# EAGLE design PWM (EAGLE 6.6.0)
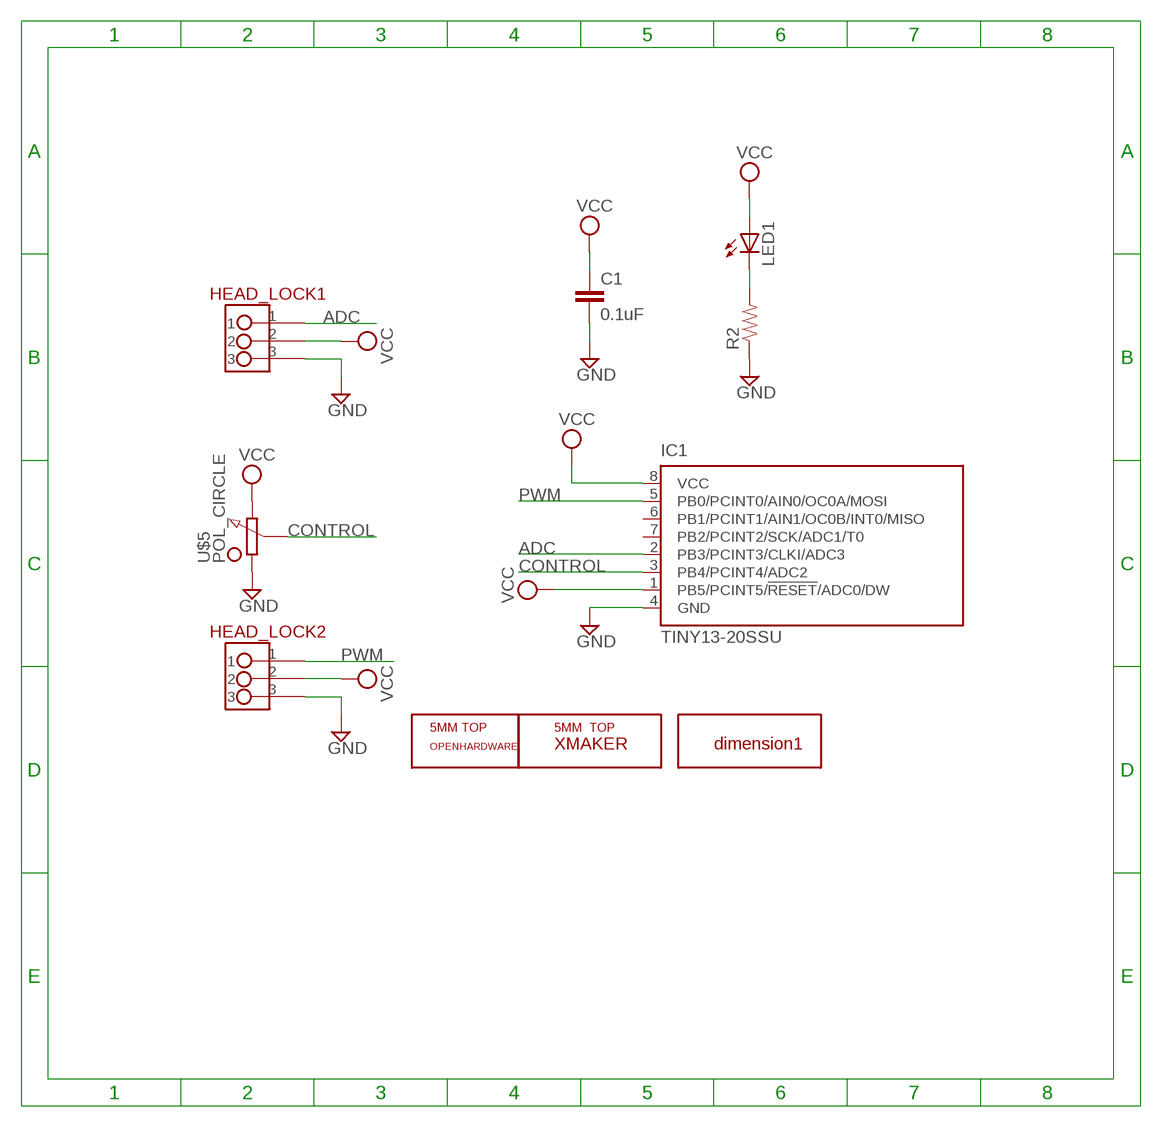
[diagram p0: schematic, sheet 1]

## Parts
C1  0.1uF  CAP0603-CAP  [0603-CAP]
HEAD_LOCK1  HEAD_LOCK  [HEAD_LOCK]
HEAD_LOCK2  HEAD_LOCK  [HEAD_LOCK]
IC1  TINY13-20SSU  [8S1]
LED1  LED_ESML0603  [LED_SML0603]
R2  0.27OHM-1/10W-1%(0603)  [0603-RES]
U$2  XMAKERLOGO_5MM_TOP  [XMAKERLOGO_5MM_TOP]
U$3  DIMENSION1  [DIMENSION1]
U$4  OPENHARDWARE_5MM_TOP  [OPENSOURCE_5MM_TOP]
U$5  POL_CIRCLE  [POT_CIRCLE]

## Nets
ADC: HEAD_LOCK1.1 IC1.2(PB3/PCINT3/CLKI/ADC3)
CONTROL: IC1.3(PB4/PCINT4/ADC2) U$5.P$2
GND: C1.2 HEAD_LOCK1.3 HEAD_LOCK2.3 IC1.4(GND) R2.1 U$5.P$3
N$1: LED1.C R2.2
PWM: HEAD_LOCK2.1 IC1.5(PB0/PCINT0/AIN0/OC0A/MOSI)
VCC: C1.1 HEAD_LOCK1.2 HEAD_LOCK2.2 IC1.1(PB5/PCINT5/!RESET!/ADC0/DW) IC1.8(VCC) LED1.A U$5.P$1
Unconnected: IC1.6(PB1/PCINT1/AIN1/OC0B/INT0/MISO) IC1.7(PB2/PCINT2/SCK/ADC1/T0)

## Library data of the parts
C1 = SparkFun-Passives:CAP: Capacitor Standard 0603 ceramic capacitor, and 0.1" leaded capacitor.
HEAD_LOCK1 HEAD_LOCK2 = Xmaker:HEAD_LOCK
IC1 = atmel:TINY13: 8-bit AVR Microcontroller with 1K Bytes In-System Programmable Flash Source: http://www.atmel.com/dyn/resources/prod_documents/2535S.pdf; MPN: ATTINY13-20SSU; OC_FARNELL: 1455133; OC_NEWARK: 58M3771
LED1 = eagle-ltspice:LED_E: LED Source: http://www.osram.convergy.de Source: www.luxeon.com Source: www.kingbright.com; SPICEMODEL: NONE; SPICEPREFIX: D; SPICETYPE: diode
R2 = SparkFun-Resistors:0.27OHM-1/10W-1%(0603): RES-08787; PROD_ID: RES-08787
U$2 = Xmaker_yuhui:XMAKERLOGO_5MM_TOP
U$3 = Xmaker_yuhui:DIMENSION1
U$4 = Xmaker_yuhui:OPENHARDWARE_5MM_TOP
U$5 = Xmaker:POL_CIRCLE

## Board
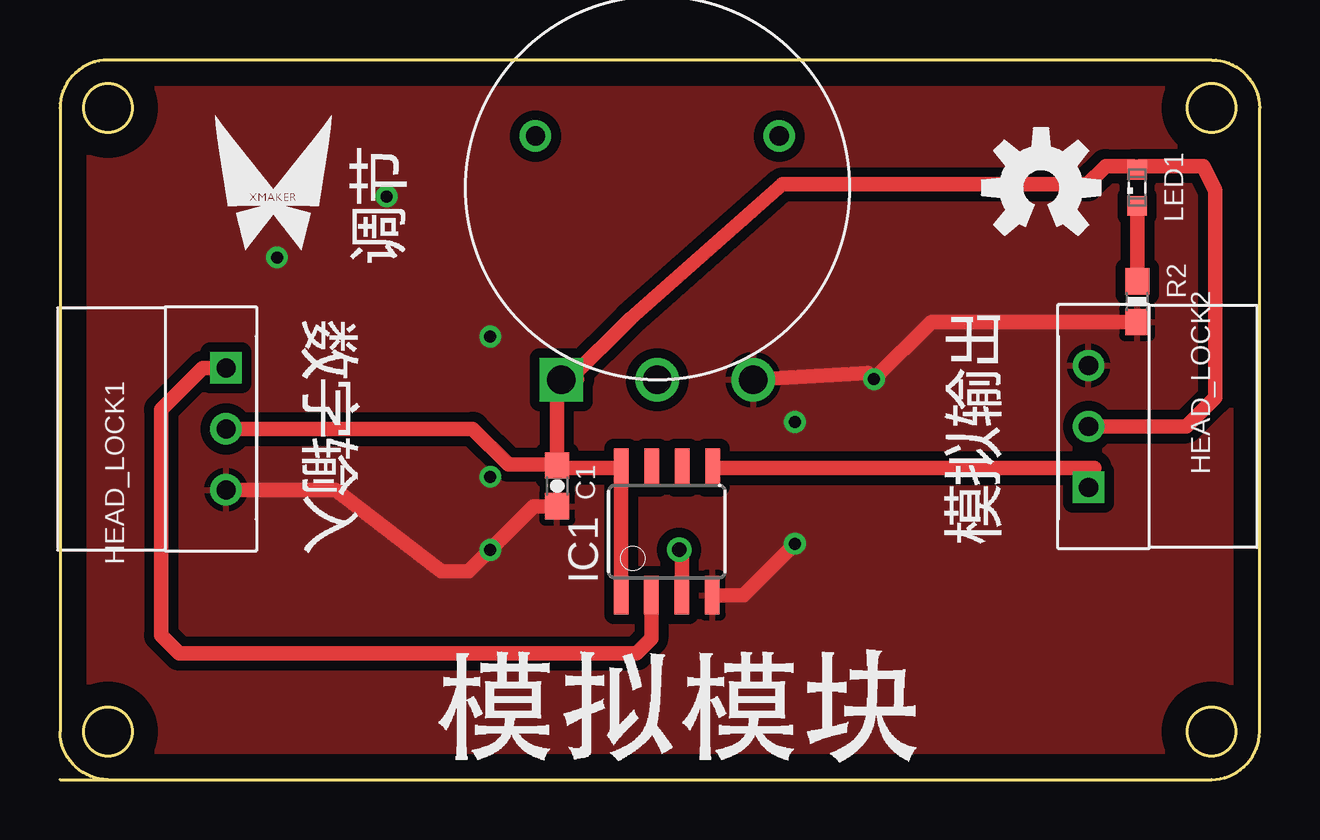
[diagram p1: board, top side]
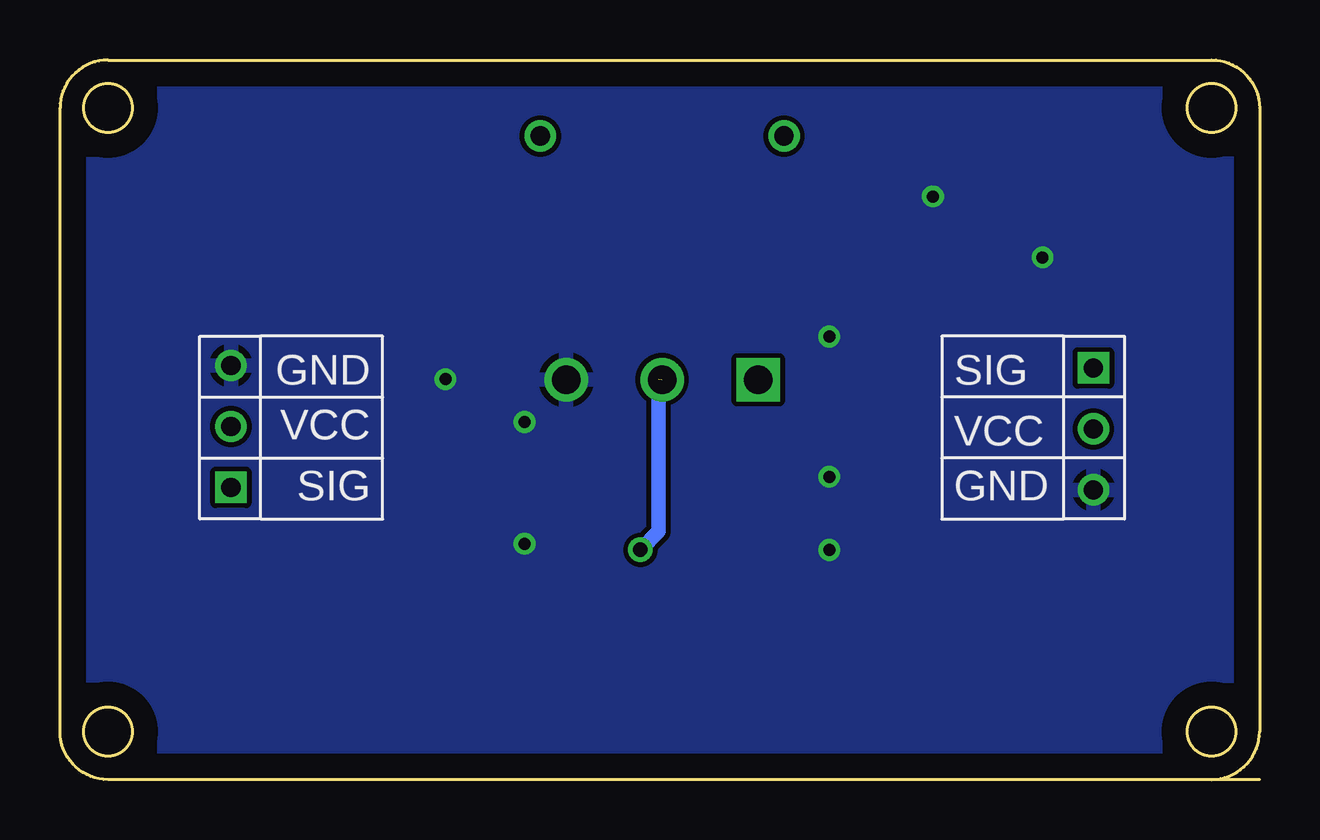
[diagram p2: board, bottom side, seen from below]

Size 50 x 30 mm. Coordinates in mm from the lower left corner, seen from the top.
Copper layers (1*16): Top 0.035mm / dielectric 1.5mm / Bottom 0.035mm
Design rules "default *": minimum track width 10mil, minimum drill 15mil, track to track 8mil, track to pad 8mil, pad to pad 8mil, via to via 8mil, smd to smd 8mil, copper to edge 40mil, drill to drill 8mil, minimum pad ring 10mil, minimum via ring 8mil, stop-mask expansion 4mil, vias tented up to drill 0mil, thermal gap 10mil

### Footprints (pad centres in the part's own frame; a part is rotated, then mirrored left to right if it is on the bottom)
0603-CAP = smd 1.1 x 1: 1 -0.85,0; 2 0.85,0
HEAD_LOCK = drill 0.8 square: 1 0.025,2.489 | drill 0.8: 2 0.025,-0.051; 3 0.025,-2.591
8S1 = smd 0.6 x 1.6: 1 -1.905,-2.654; 2 -0.645,-2.654; 3 0.625,-2.654; 4 1.895,-2.654; 5 1.905,2.654; 6 0.635,2.654; 7 -0.635,2.654; 8 -1.905,2.654
LED_SML0603 = smd 0.8 x 0.8: A 0.75,0; C -0.75,0
0603-RES = smd 1.1 x 1: 1 -0.85,0; 2 0.85,0
POT_CIRCLE = drill 1.2 square: P$1 -4,0 | drill 1.2: P$2 0,0; P$3 4,0 | drill 0.8: P$4 -5.08,10.16; P$5 5.08,10.16

### Placement (x,y rotation side)
C1  20.73,12.24 270 top
HEAD_LOCK1  6.9,14.67 0 top
HEAD_LOCK2  42.9,14.67 180 top
IC1  25.3,10.34 0 top
LED1  44.9,24.67 90 top
R2  44.9,19.92 90 top
U$2  8.9,24.67 0 top
U$3  0,0 0 top
U$4  40.9,24.67 0 top
U$5  24.9,16.67 0 top

### Tracks (layer width: path | path; a pad name or v marks a point on that pad's centre or on a via)
ADC
  Top 0.254: 24.79,6.02 24.28,5.51 24.28,5.77 24.54,6.02
  Top 0.61: IC1.2 24.65,5.88 24.28,5.51 24.03,5.26 4.98,5.26 4.22,6.02 4.22,15.42 5.96,17.16 HEAD_LOCK1.1
CONTROL  (via drill 0.61)  (1 unrouted)
  Top 0.61: IC1.3 25.92,9.46 arc90 v25.81,9.58
  Bottom 0.61: 25.04,16.69 25.04,10.34 v25.81,9.58
GND  (via drill 0.5)
  Top 0.61: R2.1 36.32,19.07 v33.93,16.69 33.68,16.94 U$5.P$3 | C1.2 19.75,11.39 v17.93,9.58 17.03,8.67 15.9,8.67 11.49,12.08 HEAD_LOCK1.3 | IC1.4 28.49,7.68 v30.63,9.83
  other vias: 9.04,21.77 13.61,24.31 17.93,18.47 17.93,12.62 30.63,14.91
  pour Top (isolate 0.406): -0.36,31.93 51.46,31.93 51.46,-1.6 -0.36,-1.6
  pour Bottom: -1.1,32.67 51.9,32.67 51.9,31.67 51.9,-2.33 -1.1,-2.33
N$1
  Top 0.61: LED1.C R2.2
PWM
  Top 0.61: IC1.5 42.32,12.99 | 42.32,12.99 43.12,12.99 | 42.32,12.99 42.87,12.43 HEAD_LOCK2.1
VCC
  Top 0.61: IC1.1 IC1.8 20.83,12.99 C1.1 | C1.1 20.73,16.43 20.98,16.69 21.23,16.69 | C1.1 20.69,13.13 18.69,13.13 17.21,14.62 HEAD_LOCK1.2 | 21.23,16.69 21.55,16.69 U$5.P$1 | 21.23,16.69 23.77,19.23 30.12,24.82 42.82,24.82 43.59,25.58 44.74,25.58 LED1.A 44.99,25.58 47.65,25.58 48.16,24.56 48.16,15.93 46.95,14.72 HEAD_LOCK2.2